# EAGLE design Adafruit T-Cobbler Plus-ADC (EAGLE 6.5.0)
COMPANY: ADAFRUIT INDUSTRIES; DRAWN: KTOWN; REV: A
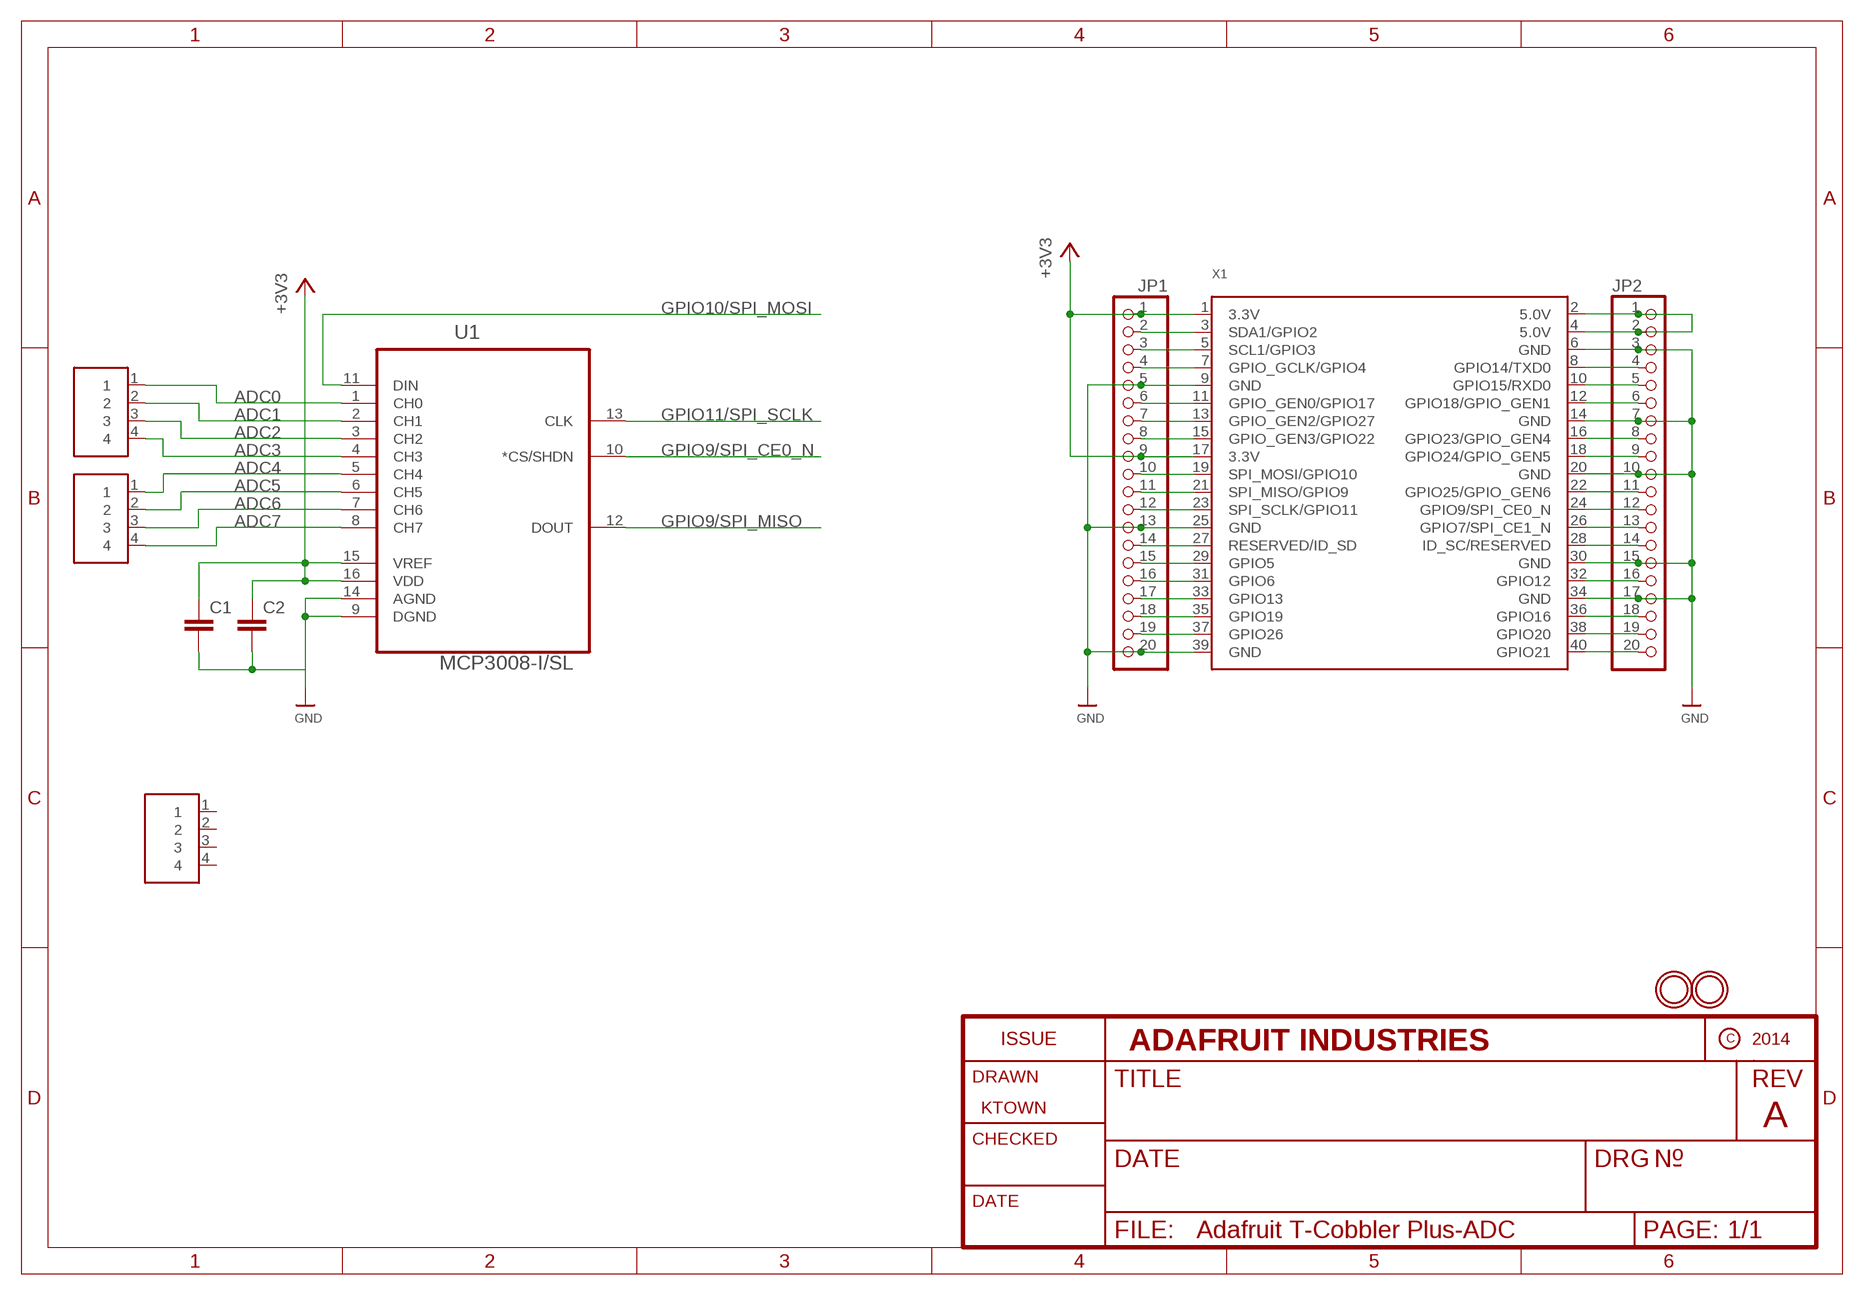
[diagram p0: schematic, sheet 1]

## Parts
C1  C-EUC0805  [C0805]
C2  C-EUC0805  [C0805]
JP1  HEADER-1X20ROUND  [1X20_ROUND]
JP2  HEADER-1X20ROUND  [1X20_ROUND]
U1  MCP3008-I/SL  [SOIC127P600X175-16N]
U$1  1X4THM  [1X4]
U$2  MOUNTINGHOLE2.5_THICK  [MOUNTINGHOLE_2.5_PLATED_THICK]
U$4  MOUNTINGHOLE2.5_THICK  [MOUNTINGHOLE_2.5_PLATED_THICK]
U$9  1X4THM  [1X4]
U$10  1X4THM  [1X4]
X1  RASPBERRYPI_B+_IDC  [RASPBERRYPI_B+_IDC]

## Nets
+3V3: C1.1 C2.1 JP1.1 JP1.9 U1.15(VREF) U1.16(VDD) X1.1(3.3V) X1.17(3.3V)
ADC0: U1.1(CH0) U$9.1
ADC1: U1.2(CH1) U$9.2
ADC2: U1.3(CH2) U$9.3
ADC3: U1.4(CH3) U$9.4
ADC4: U1.5(CH4) U$10.1
ADC5: U1.6(CH5) U$10.2
ADC6: U1.7(CH6) U$10.3
ADC7: U1.8(CH7) U$10.4
GND: C1.2 C2.2 JP1.5 JP1.13 JP1.20 JP2.3 JP2.7 JP2.10 JP2.15 JP2.17 U1.9(DGND) U1.14(AGND) X1.6(GND) X1.9(GND) X1.14(GND) X1.20(GND) X1.25(GND) X1.30(GND) X1.34(GND) X1.39(GND)
GPIO7/SPI_CE1_N: JP2.13 X1.26(GPIO7/SPI_CE1_N)
GPIO9/SPI_CE0_N: JP2.12 U1.10(*CS/SHDN) X1.24(GPIO9/SPI_CE0_N)
GPIO9/SPI_MISO: JP1.11 U1.12(DOUT) X1.21(SPI_MISO/GPIO9)
GPIO10/SPI_MOSI: JP1.10 U1.11(DIN) X1.19(SPI_MOSI/GPIO10)
GPIO11/SPI_SCLK: JP1.12 U1.13(CLK) X1.23(SPI_SCLK/GPIO11)
N$1: JP2.1 JP2.2 X1.2(5.0V) X1.4(5.0V)
N$4: JP2.4 X1.8(GPIO14/TXD0)
N$5: JP2.5 X1.10(GPIO15/RXD0)
N$6: JP2.6 X1.12(GPIO18/GPIO_GEN1)
N$8: JP2.8 X1.16(GPIO23/GPIO_GEN4)
N$9: JP2.9 X1.18(GPIO24/GPIO_GEN5)
N$11: JP2.11 X1.22(GPIO25/GPIO_GEN6)
N$14: JP2.14 X1.28(ID_SC/RESERVED)
N$16: JP2.16 X1.32(GPIO12)
N$18: JP2.18 X1.36(GPIO16)
N$19: JP2.19 X1.38(GPIO20)
N$20: JP2.20 X1.40(GPIO21)
N$22: JP1.2 X1.3(SDA1/GPIO2)
N$23: JP1.3 X1.5(SCL1/GPIO3)
N$24: JP1.4 X1.7(GPIO_GCLK/GPIO4)
N$26: JP1.6 X1.11(GPIO_GEN0/GPIO17)
N$27: JP1.7 X1.13(GPIO_GEN2/GPIO27)
N$28: JP1.8 X1.15(GPIO_GEN3/GPIO22)
N$34: JP1.14 X1.27(RESERVED/ID_SD)
N$35: JP1.15 X1.29(GPIO5)
N$36: JP1.16 X1.31(GPIO6)
N$37: JP1.17 X1.33(GPIO13)
N$38: JP1.18 X1.35(GPIO19)
N$39: JP1.19 X1.37(GPIO26)
Unconnected: U$1.1 U$1.2 U$1.3 U$1.4

## Library data of the parts
C1 C2 = rcl:C-EU: CAPACITOR, European symbol
JP1 JP2 = microbuilder:HEADER-1X20
U1 = 1203:MCP3008-I/SL: 10BIT ADC, 8 CH, SPI, SMD; MPN: MCP3008-I/SL; OC_FARNELL: 1292241; OC_NEWARK: 19C7201; PACKAGE: SOIC16; SUPPLIER: Microchip
U$1 U$9 U$10 = 1203:1X4
U$2 U$4 = microbuilder:MOUNTINGHOLE: Mounting Hole For #2 screws (0.086"/2.18mm width, 0.094"/2.4mm hole) use 2.5mm; BOM: EXCLUDE
X1 = microbuilder:RASPBERRYPI_B+_IDC

## Board
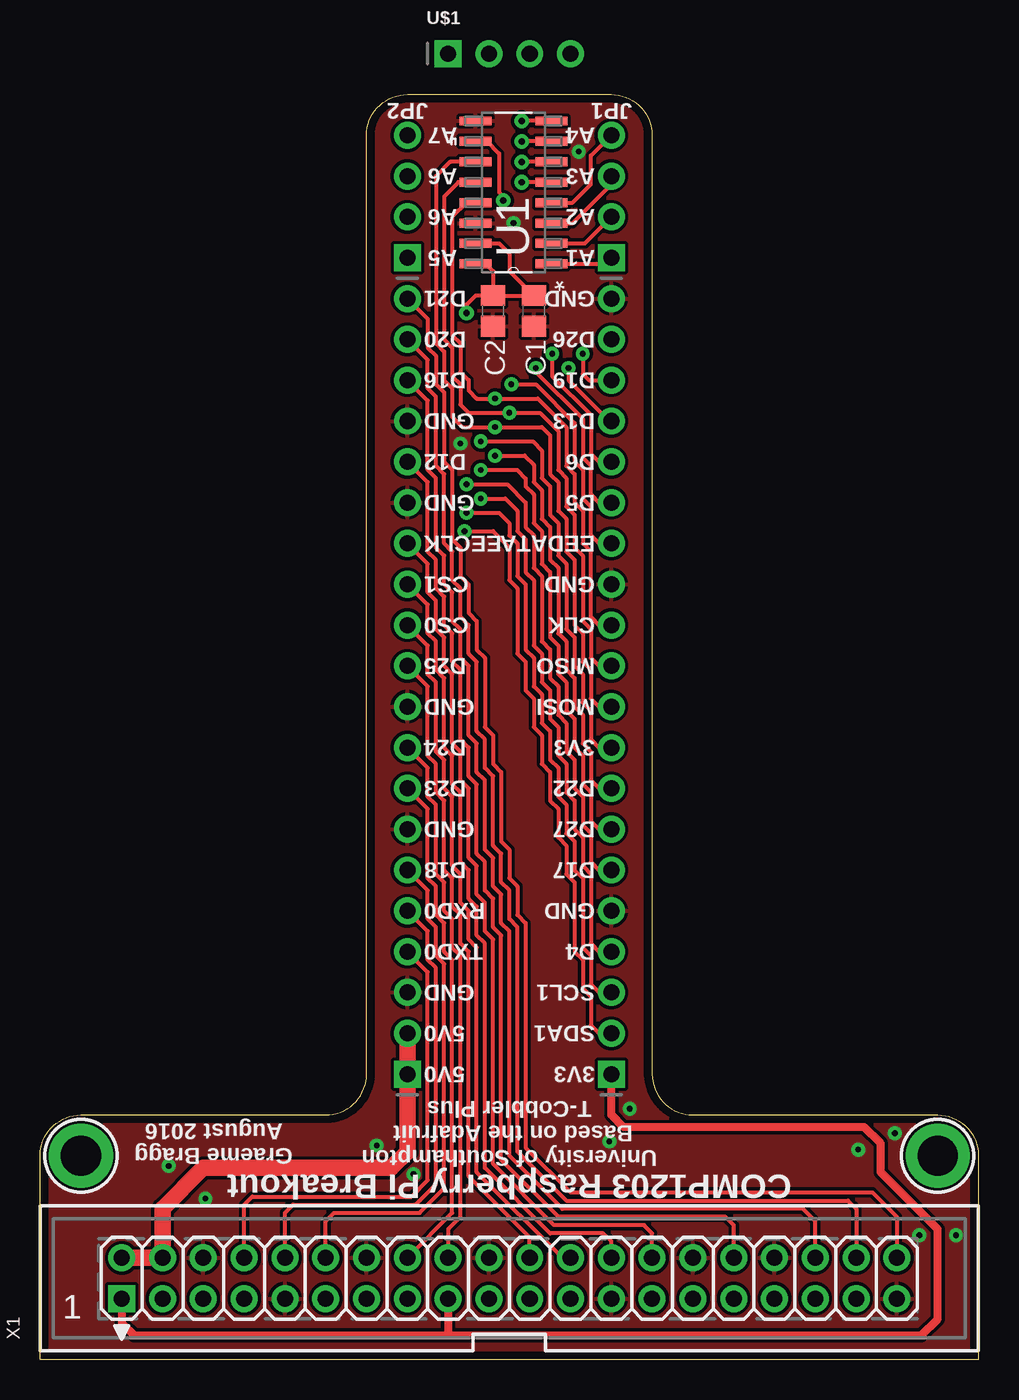
[diagram p1: board, top side]
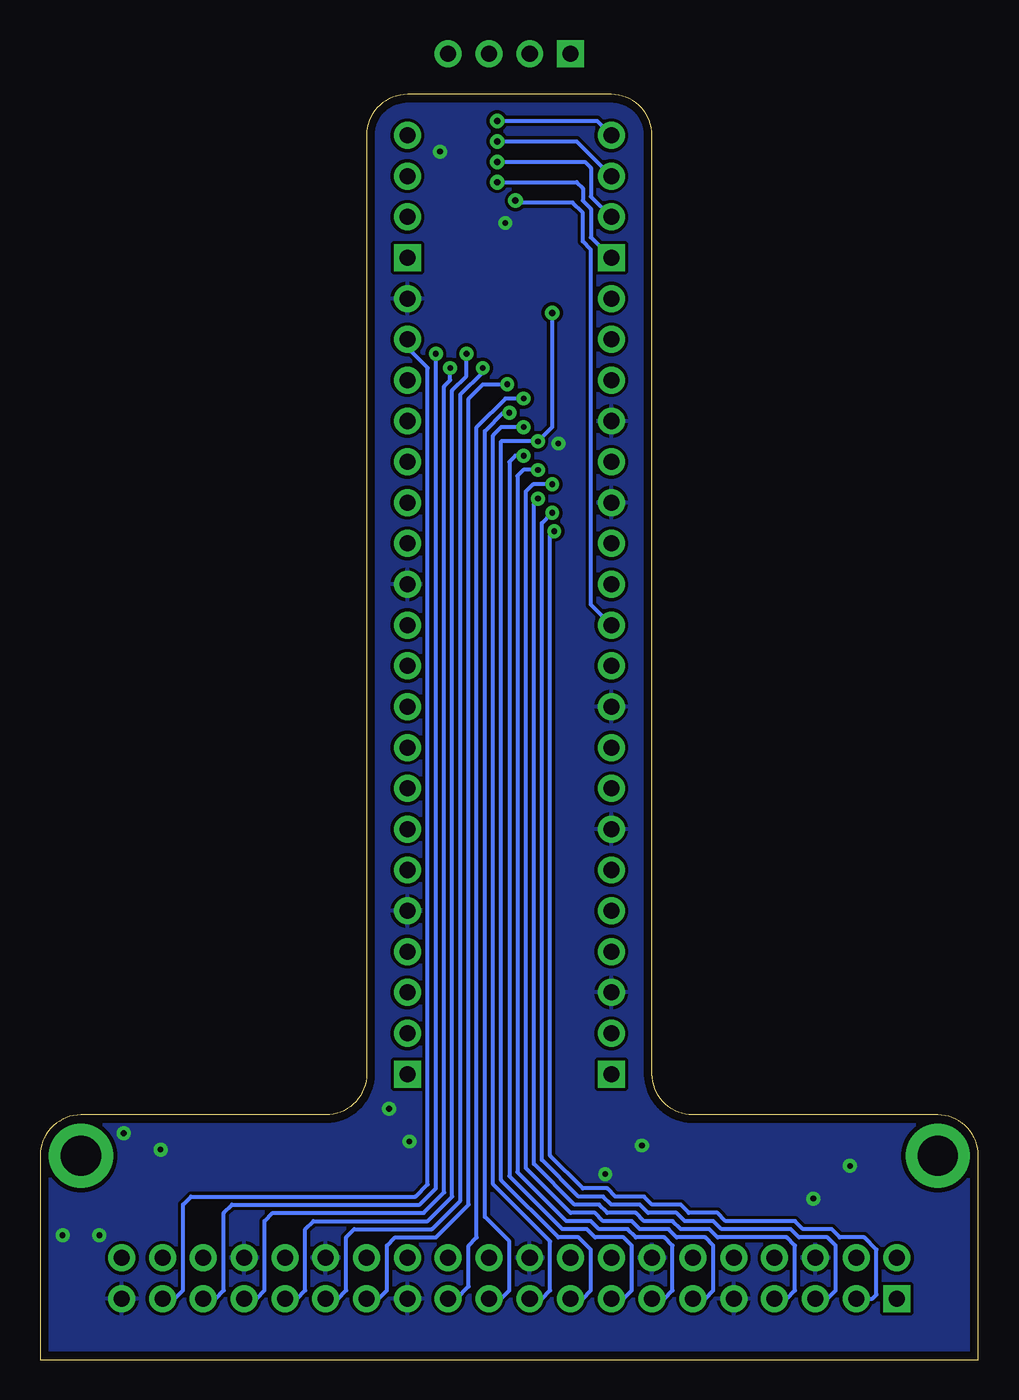
[diagram p2: board, bottom side, seen from below]

Size 58.42 x 78.74 mm. Coordinates in mm from the lower left corner, seen from the top.
Outline: 0,0 0,12.7 arc-90 2.54,15.24 17.78,15.24 arc90 20.32,17.78 20.32,76.2 arc-90 22.86,78.74 35.56,78.74 arc-90 38.1,76.2 38.1,17.78 arc90 40.64,15.24 55.88,15.24 arc-90 58.42,12.7 58.42,0 0,0
Copper layers (1*16): Top 0.035mm / dielectric 1.5mm / Bottom 0.035mm
Design rules "default *": minimum track width 8mil, minimum drill 0.2mm, track to track 8mil, track to pad 8mil, pad to pad 8mil, via to via 8mil, smd to smd 8mil, copper to edge 20mil, drill to drill 8mil, minimum pad ring 8mil, minimum via ring 10mil, stop-mask expansion 3mil, vias tented up to drill 0mil, thermal gap 8mil

### Footprints (pad centres in the part's own frame; a part is rotated, then mirrored left to right if it is on the bottom)
C0805 = smd 1.3 x 1.5: 1 -0.95,0; 2 0.95,0
1X20_ROUND = drill 1 pad 1.676 square: 1 -24.13,0 | drill 1 pad 1.676: 2 -21.59,0; 3 -19.05,0; 4 -16.51,0; 5 -13.97,0; 6 -11.43,0; 7 -8.89,0; 8 -6.35,0; 9 -3.81,0; 10 -1.27,0; 11 1.27,0; 12 3.81,0; 13 6.35,0; 14 8.89,0; 15 11.43,0; 16 13.97,0; 17 16.51,0; 18 19.05,0; 19 21.59,0; 20 24.13,0
SOIC127P600X175-16N = smd 1.981 x 0.559: 1 -2.362,4.445; 2 -2.362,3.175; 3 -2.362,1.905; 4 -2.362,0.635; 5 -2.362,-0.635; 6 -2.362,-1.905; 7 -2.362,-3.175; 8 -2.362,-4.445; 9 2.362,-4.445; 10 2.362,-3.175; 11 2.362,-1.905; 12 2.362,-0.635; 13 2.362,0.635; 14 2.362,1.905; 15 2.362,3.175; 16 2.362,4.445
1X4 = drill 1 pad 1.676 square: 1 -3.81,0 | drill 1 pad 1.676: 2 -1.27,0; 3 1.27,0; 4 3.81,0
MOUNTINGHOLE_2.5_PLATED_THICK = drill 2.5 pad 4: P$1 0,0
RASPBERRYPI_B+_IDC = drill 1 pad 1.676 square: 1 -1.27,24.13 | drill 1 pad 1.676: 2 1.27,24.13; 3 -1.27,21.59; 4 1.27,21.59; 5 -1.27,19.05; 6 1.27,19.05; 7 -1.27,16.51; 8 1.27,16.51; 9 -1.27,13.97; 10 1.27,13.97; 11 -1.27,11.43; 12 1.27,11.43; 13 -1.27,8.89; 14 1.27,8.89; 15 -1.27,6.35; 16 1.27,6.35; 17 -1.27,3.81; 18 1.27,3.81; 19 -1.27,1.27; 20 1.27,1.27; 21 -1.27,-1.27; 22 1.27,-1.27; 23 -1.27,-3.81; 24 1.27,-3.81; 25 -1.27,-6.35; 26 1.27,-6.35; 27 -1.27,-8.89; 28 1.27,-8.89; 29 -1.27,-11.43; 30 1.27,-11.43; 31 -1.27,-13.97; 32 1.27,-13.97; 33 -1.27,-16.51; 34 1.27,-16.51; 35 -1.27,-19.05; 36 1.27,-19.05; 37 -1.27,-21.59; 38 1.27,-21.59; 39 -1.27,-24.13; 40 1.27,-24.13

### Placement (x,y rotation side)
C1  30.73,65.28 270 top
C2  28.19,65.28 270 top
JP1  35.56,41.91 90 top
JP2  22.86,41.91 90 top
U1  29.46,72.64 180 top
U$1  29.21,81.28 0 top
U$2  2.54,12.7 0 top
U$4  55.88,12.7 0 top
U$9  35.56,72.39 90 top
U$10  22.86,72.39 90 top
X1  29.21,5.08 90 top

### Tracks (layer width: path | path; a pad name or v marks a point on that pad's centre or on a via)
+3V3  (via drill 0.36, 0.4)
  Top 0.254: v27.43,57.15 30.67,57.15 31.24,56.58 31.24,54.86 31.75,54.36 31.75,52.58 32.26,52.07 32.26,50.04 32.77,49.53 32.77,45.47 33.27,44.96 33.27,43.18 33.78,42.67 33.78,40.89 34.29,40.39 34.29,38.61 34.8,38.1 JP1.9 | U1.15 28.57,69.47 29.21,68.83 29.21,67.75 C1.1 C2.1 | U1.16 27.74,68.2 28.19,67.74 C2.1 | C2.1 27.11,66.23 26.54,65.66 v26.54,65.15
  Top 0.508: X1.1 5.08,2.29 5.84,1.52 25.4,1.52 | 25.4,1.52 54.86,1.52 55.88,2.54 55.88,8.13 52.32,11.68 52.32,13.46 51.31,14.48 36.32,14.48 35.56,15.24 JP1.1 | X1.17 25.4,1.52
  Bottom 0.254: v26.54,65.15 26.54,58.04 v27.43,57.15 29.72,57.15 29.72,11.18 26.16,7.62 24.89,7.62 24.13,6.86 24.13,4.32 24.64,3.81 X1.17
ADC0
  Top 0.254: U1.1 35.18,68.2 U$9.1
ADC1
  Top 0.254: U1.2 33.91,69.47 U$9.2
ADC2
  Top 0.254: U1.3 33.15,70.74 35.56,73.15 U$9.3
ADC3
  Top 0.254: U1.4 33.15,72.01 34.29,73.15 34.29,74.93 U$9.4
ADC4  (via drill 0.4)
  Top 0.254: U1.5 v29.97,73.28
  Bottom 0.254: v29.97,73.28 25.02,73.28 24.64,72.9 24.64,72.14 24.13,71.63 24.13,69.85 U$10.1
ADC5  (via drill 0.4)
  Top 0.254: U1.6 v29.97,74.55
  Bottom 0.254: v29.97,74.55 24.51,74.55 24.13,74.17 24.13,72.39 U$10.2
ADC6  (via drill 0.4)
  Top 0.254: U1.7 v29.97,75.82
  Bottom 0.254: v29.97,75.82 25.02,75.82 U$10.3
ADC7  (via drill 0.4)
  Top 0.254: U1.8 v29.97,77.09
  Bottom 0.254: v29.97,77.09 23.75,77.09 U$10.4
GND  (via drill 0.36)
  other vias: 29.46,70.74 26.16,57.02 33.53,75.18 23.24,11.56 20.96,13.34 36.7,15.62 35.43,13.59 50.93,13.08 53.21,14.1 54.74,7.75 57.02,7.75 10.29,10.03 8,12.06
  pour Bottom: 0,0 0,12.7 arc-90 2.54,15.24 17.78,15.24 arc90 20.32,17.78 20.32,76.2 arc-90 22.86,78.74 35.56,78.74 arc-90 38.1,76.2 38.1,17.78 arc90 40.64,15.24 55.88,15.24 arc-90 58.42,12.7 58.42,0
  pour Top: 0,0 0,12.7 arc-90 2.54,15.24 17.78,15.24 arc90 20.32,17.78 20.32,76.2 arc-90 22.86,78.74 35.56,78.74 arc-90 38.1,76.2 38.1,17.78 arc90 40.64,15.24 55.88,15.24 arc-90 58.42,12.7 58.42,0
GPIO7/SPI_CE1_N
  Top 0.254: X1.26 35.56,7.37 35.05,7.87 31.75,7.87 27.69,11.94 27.69,25.91 27.18,26.42 27.18,28.19 26.67,28.7 26.67,30.48 26.16,30.99 26.16,35.31 25.65,35.81 25.65,37.59 25.15,38.1 25.15,42.42 24.64,42.93 24.64,44.7 24.13,45.21 24.13,46.99 JP2.13
GPIO9/SPI_CE0_N  (via drill 0.4)
  Top 0.254: X1.24 32.51,6.35 27.18,11.68 27.18,25.65 26.67,26.16 26.67,27.94 26.16,28.45 26.16,30.23 25.65,30.73 25.65,35.05 25.15,35.56 25.15,37.34 24.64,37.85 24.64,42.16 24.13,42.67 24.13,44.45 JP2.12 | U1.10 27.81,75.82 28.57,75.06 28.57,72.64 28.83,72.39 v28.83,72.14
  Bottom 0.254: JP2.12 24.13,46.99 24.13,69.09 24.64,69.6 24.64,71.37 25.27,72.01 28.57,72.01 v28.83,72.14
GPIO9/SPI_MISO  (via drill 0.36)
  Top 0.254: JP1.11 34.8,43.18 34.29,43.69 34.29,45.47 33.78,45.97 33.78,50.04 33.27,50.55 33.27,52.58 32.77,53.09 32.77,54.86 32.26,55.37 32.26,57.78 31.11,58.93 v29.21,58.93 26.67,58.93 26.16,59.44 26.16,60.71 25.65,61.21 25.65,62.99 25.15,63.5 25.15,72.39 26.04,73.28 U1.12
  Bottom 0.254: X1.21 29.72,3.81 29.21,4.32 29.21,7.37 30.73,8.89 30.73,57.78 29.59,58.93 v29.21,58.93
GPIO10/SPI_MOSI  (via drill 0.36)
  Top 0.254: JP1.10 34.8,40.64 34.29,41.15 34.29,42.93 33.78,43.43 33.78,45.21 33.27,45.72 33.27,49.78 32.77,50.29 32.77,52.32 32.26,52.83 32.26,54.61 31.75,55.12 31.75,57.53 31.24,58.04 v28.32,58.04 26.29,58.04 25.65,58.67 25.65,60.45 25.15,60.96 25.15,62.74 24.64,63.25 24.64,73.66 25.53,74.55 U1.11
  Bottom 0.254: X1.19 27.18,3.81 26.67,4.32 26.67,7.37 30.23,10.92 30.23,57.53 29.72,58.04 v28.32,58.04
GPIO11/SPI_SCLK  (via drill 0.36)
  Top 0.254: JP1.12 34.8,45.72 34.29,46.23 34.29,50.29 33.78,50.8 33.78,52.83 33.27,53.34 33.27,55.12 32.77,55.63 32.77,58.04 30.99,59.82 v28.32,59.82 27.18,59.82 26.67,60.33 26.67,60.96 26.16,61.47 26.16,63.25 25.65,63.75 25.65,71.12 26.54,72.01 U1.13
  Bottom 0.254: X1.23 32.51,3.81 31.75,4.57 31.75,7.11 31.24,7.62 31.24,58.04 29.46,59.82 v28.32,59.82
N$1
  Top 1.016: X1.2 X1.4 7.62,9.4 10.16,11.94 21.84,11.94 22.86,12.95 JP2.1 JP2.2
N$4
  Top 0.254: X1.8 12.7,9.65 13.21,10.16 23.11,10.16 24.13,11.18 24.13,24.13 JP2.4
N$5
  Top 0.254: X1.10 15.24,9.14 15.75,9.65 23.37,9.65 24.64,10.92 24.64,24.38 24.13,24.89 24.13,26.67 JP2.5
N$6
  Top 0.254: X1.12 17.78,8.64 18.29,9.14 23.62,9.14 25.15,10.67 25.15,24.64 24.64,25.15 24.64,26.92 24.13,27.43 24.13,29.21 JP2.6
N$8
  Top 0.254: X1.16 25.65,9.14 25.65,24.89 25.15,25.4 25.15,27.18 24.64,27.69 24.64,29.46 24.13,29.97 24.13,34.29 JP2.8
N$9
  Top 0.254: X1.18 25.4,8.13 26.16,8.89 26.16,25.15 25.65,25.65 25.65,27.43 25.15,27.94 25.15,29.72 24.64,30.23 24.64,34.54 24.13,35.05 24.13,36.83 JP2.9
N$11
  Top 0.254: X1.22 30.48,7.62 26.67,11.43 26.67,25.4 26.16,25.91 26.16,27.69 25.65,28.19 25.65,29.97 25.15,30.48 25.15,34.8 24.64,35.31 24.64,37.08 24.13,37.59 24.13,41.91 JP2.11
N$14
  Top 0.254: X1.28 38.1,7.87 37.59,8.38 32,8.38 28.19,12.19 28.19,26.16 27.69,26.67 27.69,28.45 27.18,28.96 27.18,30.73 26.67,31.24 26.67,35.56 26.16,36.07 26.16,37.85 25.65,38.35 25.65,42.67 25.15,43.18 25.15,44.96 24.64,45.47 24.64,47.24 24.13,47.75 24.13,49.53 JP2.14
N$16
  Top 0.254: X1.32 43.18,8.38 42.67,8.89 32.26,8.89 28.7,12.45 28.7,26.42 28.19,26.92 28.19,28.7 27.69,29.21 27.69,30.99 27.18,31.5 27.18,35.81 26.67,36.32 26.67,38.1 26.16,38.61 26.16,42.93 25.65,43.43 25.65,45.21 25.15,45.72 25.15,47.5 24.64,48.01 24.64,49.78 24.13,50.29 24.13,54.61 JP2.16
N$18
  Top 0.254: X1.36 48.26,8.64 47.5,9.4 32.51,9.4 29.21,12.7 29.21,26.67 28.7,27.18 28.7,28.96 28.19,29.46 28.19,31.24 27.69,31.75 27.69,36.07 27.18,36.58 27.18,38.35 26.67,38.86 26.67,43.18 26.16,43.69 26.16,45.47 25.65,45.97 25.65,47.75 25.15,48.26 25.15,50.04 24.64,50.55 24.64,54.86 24.13,55.37 24.13,59.69 JP2.18
N$19
  Top 0.254: X1.38 50.8,9.4 50.29,9.91 32.77,9.91 29.72,12.95 29.72,26.92 29.21,27.43 29.21,29.21 28.7,29.72 28.7,31.5 28.19,32 28.19,36.32 27.69,36.83 27.69,38.61 27.18,39.12 27.18,43.43 26.67,43.94 26.67,45.72 26.16,46.23 26.16,48.01 25.65,48.51 25.65,50.29 25.15,50.8 25.15,55.12 24.64,55.63 24.64,59.94 24.13,60.45 24.13,62.23 JP2.19
N$20
  Top 0.254: JP2.20 24.13,64.77 24.13,62.99 24.64,62.48 24.64,60.71 25.15,60.2 25.15,55.88 25.65,55.37 25.65,51.05 26.16,50.55 26.16,48.77 26.67,48.26 26.67,46.48 27.18,45.97 27.18,44.2 27.69,43.69 27.69,39.37 28.19,38.86 28.19,37.08 28.7,36.58 28.7,32.26 29.21,31.75 29.21,29.97 29.72,29.46 29.72,27.69 30.23,27.18 30.23,13.21 33.02,10.41 51.82,10.41 53.34,8.89 X1.40
N$22  (via drill 0.36)
  Top 0.254: v26.42,51.56 28.19,51.56 29.21,50.55 29.21,48.51 29.72,48.01 29.72,43.94 30.23,43.43 30.23,41.66 30.73,41.15 30.73,39.37 31.24,38.86 31.24,37.08 31.75,36.58 31.75,34.8 32.26,34.29 32.26,32.51 32.77,32 32.77,30.23 33.27,29.72 33.27,25.4 33.78,24.89 33.78,23.11 34.29,22.61 34.29,20.83 34.8,20.32 JP1.2
  Bottom 0.254: X1.3 6.6,3.81 6.35,4.06 6.35,6.86 7.11,7.62 8.64,7.62 9.14,8.13 10.92,8.13 11.43,8.64 15.75,8.64 16.26,9.14 18.03,9.14 18.54,9.65 20.32,9.65 20.83,10.16 22.61,10.16 23.11,10.67 24.64,10.67 26.67,12.7 26.67,51.31 v26.42,51.56
N$23  (via drill 0.36)
  Top 0.254: v26.54,52.7 28.57,52.7 29.21,52.07 29.21,51.31 29.72,50.8 29.72,48.77 30.23,48.26 30.23,44.2 30.73,43.69 30.73,41.91 31.24,41.4 31.24,39.62 31.75,39.12 31.75,37.34 32.26,36.83 32.26,35.05 32.77,34.54 32.77,32.77 33.27,32.26 33.27,30.48 33.78,29.97 33.78,25.65 34.29,25.15 34.29,23.37 34.8,22.86 JP1.3
  Bottom 0.254: X1.5 9.4,3.81 8.89,4.32 8.89,7.11 9.4,7.62 11.18,7.62 11.68,8.13 16,8.13 16.51,8.64 18.29,8.64 18.8,9.14 20.57,9.14 21.08,9.65 22.86,9.65 23.37,10.16 24.89,10.16 27.18,12.45 27.18,52.07 v26.54,52.7
N$24  (via drill 0.36)
  Top 0.254: v27.43,53.59 28.96,53.59 29.72,52.83 29.72,51.56 30.23,51.05 30.23,49.02 30.73,48.51 30.73,44.45 31.24,43.94 31.24,42.16 31.75,41.66 31.75,39.88 32.26,39.37 32.26,37.59 32.77,37.08 32.77,35.31 33.27,34.8 33.27,33.02 33.78,32.51 33.78,30.73 34.29,30.23 34.29,25.91 34.8,25.4 JP1.4
  Bottom 0.254: X1.7 11.94,3.81 11.43,4.32 11.43,7.11 11.94,7.62 16.26,7.62 16.76,8.13 18.54,8.13 19.05,8.64 20.83,8.64 21.34,9.14 23.11,9.14 23.62,9.65 25.15,9.65 27.69,12.19 27.69,53.21 v27.43,53.59
N$26  (via drill 0.36)
  Top 0.254: v26.54,54.48 29.08,54.48 30.23,53.34 30.23,51.82 30.73,51.31 30.73,49.28 31.24,48.77 31.24,44.7 31.75,44.2 31.75,42.42 32.26,41.91 32.26,40.13 32.77,39.62 32.77,37.85 33.27,37.34 33.27,35.56 33.78,35.05 33.78,33.27 34.29,32.77 34.29,30.99 34.8,30.48 JP1.6
  Bottom 0.254: X1.11 17.02,3.81 16.51,4.32 16.51,7.11 17.02,7.62 18.8,7.62 19.3,8.13 21.08,8.13 21.59,8.64 23.37,8.64 23.88,9.14 25.4,9.14 28.19,11.94 28.19,54.02 27.74,54.48 v26.54,54.48
N$27  (via drill 0.36)
  Top 0.254: v27.43,55.37 29.69,55.37 30.23,54.83 30.23,54.36 30.73,53.85 30.73,52.07 31.24,51.56 31.24,49.53 31.75,49.02 31.75,44.96 32.26,44.45 32.26,42.67 32.77,42.16 32.77,40.39 33.27,39.88 33.27,38.1 33.78,37.59 33.78,35.81 34.29,35.31 34.29,33.53 34.8,33.02 JP1.7
  Bottom 0.254: X1.13 19.56,3.81 19.05,4.32 19.05,7.11 19.56,7.62 21.34,7.62 21.84,8.13 23.62,8.13 24.13,8.64 25.65,8.64 28.7,11.68 28.7,55.01 28.34,55.37 v27.43,55.37
N$28  (via drill 0.36)
  Top 0.254: v28.32,56.26 30.17,56.26 30.73,55.69 30.73,54.61 31.24,54.1 31.24,52.32 31.75,51.82 31.75,49.78 32.26,49.28 32.26,45.21 32.77,44.7 32.77,42.93 33.27,42.42 33.27,40.64 33.78,40.13 33.78,38.35 34.29,37.85 34.29,36.07 34.8,35.56 JP1.8
  Bottom 0.254: X1.15 22.1,3.81 21.59,4.32 21.59,7.11 22.1,7.62 23.88,7.62 24.38,8.13 25.91,8.13 29.21,11.43 29.21,55.88 28.83,56.26 v28.32,56.26
N$34  (via drill 0.36)
  Top 0.254: v29.34,60.71 30.86,60.71 33.27,58.29 33.27,55.88 33.78,55.37 33.78,53.59 34.29,53.09 34.29,51.31 34.8,50.8 JP1.14
  Bottom 0.254: X1.27 37.34,3.81 36.83,4.32 36.83,7.11 36.32,7.62 33.78,7.62 31.75,9.65 31.75,59.82 30.86,60.71 v29.34,60.71
N$35  (via drill 0.36)
  Top 0.254: v30.86,61.72 30.86,61.47 33.78,58.55 33.78,56.13 34.29,55.63 34.29,53.85 34.8,53.34 JP1.15
  Bottom 0.254: X1.29 39.88,3.81 39.37,4.32 39.37,7.62 38.86,8.13 34.04,8.13 32.26,9.91 32.26,60.07 30.86,61.47 v30.86,61.72
N$36  (via drill 0.36)
  Top 0.254: v31.88,62.61 31.88,61.21 34.29,58.8 34.29,56.39 34.8,55.88 JP1.16
  Bottom 0.254: X1.31 42.42,3.81 41.91,4.32 41.91,8.13 41.4,8.64 34.29,8.64 32.77,10.16 32.77,60.33 31.88,61.21 v31.88,62.61
N$37  (via drill 0.36)
  Top 0.254: v32.89,61.72 32.89,60.96 35.56,58.29 JP1.17
  Bottom 0.254: X1.33 44.96,3.81 44.45,4.32 44.45,8.64 43.94,9.14 34.54,9.14 33.27,10.41 33.27,60.58 32.89,60.96 v32.89,61.72
N$38  (via drill 0.36)
  Top 0.254: v33.78,62.61 33.78,61.34 34.16,60.96 JP1.18
  Bottom 0.254: X1.35 47.5,3.81 46.99,4.32 46.99,9.14 46.48,9.65 34.8,9.65 33.78,10.67 v33.78,62.61
N$39
  Bottom 0.254: X1.37 50.04,3.81 49.53,4.32 49.53,9.65 49.02,10.16 35.05,10.16 34.29,10.92 34.29,61.72 35.56,62.99 JP1.19

### Text on the board
tPlace: A7 | A4 | A6 | A3 | A6 | A2 | A5 | A1 | D21 | GND | D20 | D26 | D16 | D19 | GND | D13 | D12 | D6 | GND | D5 | EECLK | EEDATA | CS1 | GND | CS0 | CLK | D25 | MISO | GND | MOSI | D24 | 3V3 | D23 | D22 | GND | D27 | D18 | D17 | RXD0 | GND | TXD0 | D4 | GND | SCL1 | 5V0 | SDA1 | 5V0 | 3V3 | University of Southampton / Based on the Adafruit / T-Cobbler Plus | Graeme Bragg / August 2016 | COMP1203 Raspberry Pi Breakout